# EAGLE design ambient_tag_v1 (EAGLE 7.6.0)
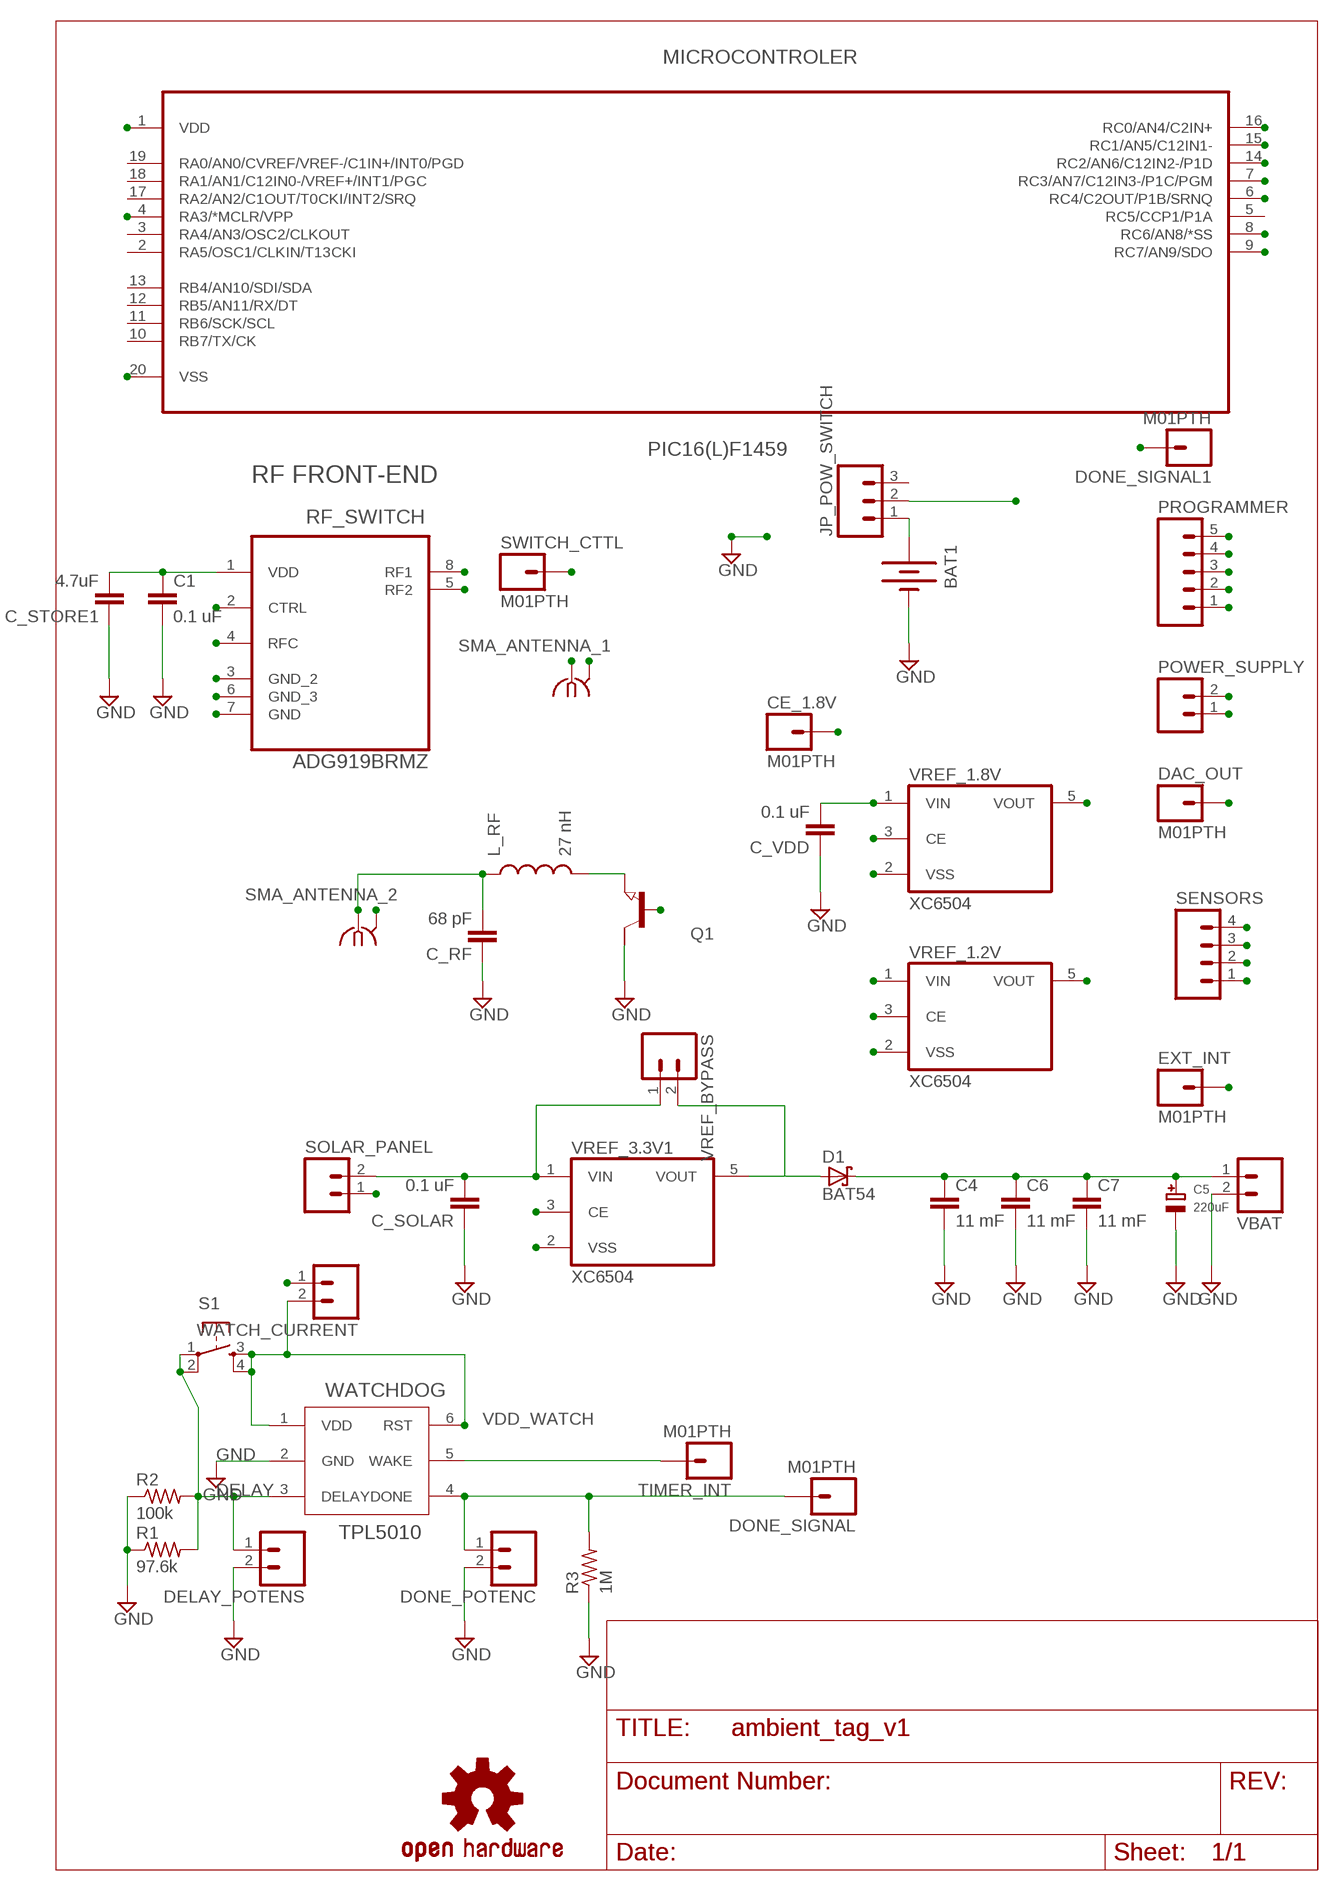
[diagram p0: schematic, sheet 1]

## Parts
BAT1  BATTERY20PTH_LAB  [BATTCOM_20MM_PTH]
C1  0.1 uF  CAP0603-CAP  [0603-CAP]
C4  11 mF  CAP1210  [1210]
C5  220uF  CAP_TANTALUMD/7343_REFLOW  [EIA7343-31/D-R]
C6  11 mF  CAP1210  [1210]
C7  11 mF  CAP1210  [1210]
C_RF  68 pF  CAP0603-CAP  [0603-CAP]
C_SOLAR  0.1 uF  CAP0603-CAP  [0603-CAP]
C_STORE1  4.7uF  1.0UF-25V-+80/-20(0805)  [0805]
C_VDD  0.1 uF  CAP0603-CAP  [0603-CAP]
CE_1.8V  M01PTH  [1X01]
D1  BAT54  [SOT23]
DAC_OUT  M01PTH  [1X01]
DELAY_POTENS  M02PTH  [1X02]
DONE_POTENC  M02PTH  [1X02]
DONE_SIGNAL  M01PTH  [1X01]
DONE_SIGNAL1  M01PTH  [1X01]
EXT_INT  M01PTH  [1X01]
JP_POW_SWITCH  M03LOCK  [1X03_LOCK]
L_RF  27 nH  INDUCTOR0603  [0603]
LOGO1  OSHW-LOGOL  [OSHW-LOGO-L]
MICROCONTROLER  PIC16(L)F1459  PIC18F13K22-I/SS  [SOP65P780X200-20N]
POWER_SUPPLY  M02PTH  [1X02]
PROGRAMMER  M05PTH  [1X05]
Q1  NPN-TRANSISTIOR-2COLSOT89  [SOT89]
R1  97.6k  R-US_R0805  [R0805]
R2  100k  R-US_R0805  [R0805]
R3  1M  R-US_R0805  [R0805]
RF_SWITCH  ADG919BRMZ  [SOP65P490X110-8N]
S1  TAC_SWITCHSMD  [TACTILE_SWITCH_SMD]
SENSORS  M04LOCK  [1X04_LOCK]
SMA_ANTENNA_1  SMA-142-0701-881/886  [J502-ND-142-0701-881/886]
SMA_ANTENNA_2  SMA-142-0701-881/886  [J502-ND-142-0701-881/886]
SOLAR_PANEL  M02PTH  [1X02]
SWITCH_CTTL  M01PTH  [1X01]
TIMER_INT  M01PTH  [1X01]
VBAT  M02PTH  [1X02]
VREF_1.2V  XC6504  XC6220MR  [SOT23-5]
VREF_1.8V  XC6504  XC6220MR  [SOT23-5]
VREF_3.3V1  XC6504  XC6220MR  [SOT23-5]
VREF_BYPASS  M02PTH  [1X02]
WATCH_CURRENT  M02PTH  [1X02]
WATCHDOG  TPL5010  [TSOT-23]

## Nets
CE: CE_1.8V.1 VREF_1.8V.3(CE)
DAC1: DAC_OUT.1 MICROCONTROLER.14(RC2/AN6/C12IN2-/P1D) Q1.1(B)
DELAY: DELAY_POTENS.1 R1.2 R2.2 S1.1 S1.2 WATCHDOG.3(DELAY)
DONE: DONE_POTENC.1 DONE_SIGNAL.1 R3.2 WATCHDOG.4(DONE)
DONE_OUT: DONE_SIGNAL1.1 MICROCONTROLER.7(RC3/AN7/C12IN3-/P1C/PGM)
GND: BAT1.2(-) C1.2 C4.2 C5.- C6.2 C7.2 C_RF.1 C_SOLAR.1 C_STORE1.1 C_VDD.1 DELAY_POTENS.2 DONE_POTENC.2 MICROCONTROLER.20(VSS) POWER_SUPPLY.1 PROGRAMMER.3 Q1.2(C) R1.1 R2.1 R3.1 RF_SWITCH.3(GND_2) RF_SWITCH.6(GND_3) RF_SWITCH.7(GND) SENSORS.1 SENSORS.3 SMA_ANTENNA_2.G@1 SMA_ANTENNA_2.G@2 SMA_ANTENNA_2.G@3 SMA_ANTENNA_2.G@4 SOLAR_PANEL.1 VBAT.2 VREF_1.2V.2(VSS) VREF_1.8V.2(VSS) VREF_3.3V1.2(VSS) WATCHDOG.2(GND)
MCLR: MICROCONTROLER.4(RA3/*MCLR/VPP) PROGRAMMER.5
N$1: L_RF.2 Q1.3(E)
N$2: TIMER_INT.1 WATCHDOG.5(WAKE)
N$3: D1.1(A) VREF_3.3V1.5(VOUT) VREF_BYPASS.2
N$6: BAT1.1(+) JP_POW_SWITCH.1
RF1: RF_SWITCH.8(RF1)
RF2: RF_SWITCH.5(RF2) SMA_ANTENNA_1.G@1 SMA_ANTENNA_1.G@2 SMA_ANTENNA_1.G@3 SMA_ANTENNA_1.G@4
RFC: RF_SWITCH.4(RFC) SMA_ANTENNA_1.1
SENSOR1: MICROCONTROLER.8(RC6/AN8/*SS) SENSORS.4
SENSOR2: MICROCONTROLER.9(RC7/AN9/SDO) SENSORS.2
SOLAR: C_SOLAR.2 SOLAR_PANEL.2 VREF_3.3V1.1(VIN) VREF_3.3V1.3(CE) VREF_BYPASS.1
SPCLK: EXT_INT.1 MICROCONTROLER.15(RC1/AN5/C12IN1-) PROGRAMMER.1
SPDAT: MICROCONTROLER.16(RC0/AN4/C2IN+) PROGRAMMER.2 VREF_1.2V.5(VOUT)
SWITCH_CTTL: MICROCONTROLER.6(RC4/C2OUT/P1B/SRNQ) RF_SWITCH.2(CTRL) SWITCH_CTTL.1
TRANSISTOR_OUT: C_RF.2 L_RF.1 SMA_ANTENNA_2.1
VDD: C4.1 C5.+ C6.1 C7.1 C_VDD.2 D1.3(C) JP_POW_SWITCH.2 VBAT.1 VREF_1.8V.1(VIN) WATCH_CURRENT.1
VDD_1.8V: C1.1 C_STORE1.2 MICROCONTROLER.1(VDD) POWER_SUPPLY.2 PROGRAMMER.4 RF_SWITCH.1(VDD) VREF_1.2V.1(VIN) VREF_1.2V.3(CE) VREF_1.8V.5(VOUT)
VDD_WATCH: S1.3 S1.4 WATCH_CURRENT.2 WATCHDOG.1(VDD) WATCHDOG.6(RST)
Unconnected: JP_POW_SWITCH.3 MICROCONTROLER.2(RA5/OSC1/CLKIN/T13CKI) MICROCONTROLER.3(RA4/AN3/OSC2/CLKOUT) MICROCONTROLER.5(RC5/CCP1/P1A) MICROCONTROLER.10(RB7/TX/CK) MICROCONTROLER.11(RB6/SCK/SCL) MICROCONTROLER.12(RB5/AN11/RX/DT) MICROCONTROLER.13(RB4/AN10/SDI/SDA) MICROCONTROLER.17(RA2/AN2/C1OUT/T0CKI/INT2/SRQ) MICROCONTROLER.18(RA1/AN1/C12IN0-/VREF+/INT1/PGC) MICROCONTROLER.19(RA0/AN0/CVREF/VREF-/C1IN+/INT0/PGD) Q1.2@1(C/)

## Notes on the sheet
- RF FRONT-END

## Library data of the parts
BAT1 = semipassiveTag_library:BATTERY: Battery Holders Various common sizes : AA, AAA, 20mm coin cell and 12mm coin cell.
C1 C_RF C_SOLAR C_VDD = SparkFun-Capacitors:CAP: Capacitor Standard 0603 ceramic capacitor, and 0.1" leaded capacitor.
C4 C6 C7 = SparkFun:CAP: Capacitor Standard 0603 ceramic capacitor, and 0.1" leaded capacitor.
C5 = microbuilder:CAP_TANTALUM: Tantalum Capacitors Wave footprints have larger pads and are meant to be used for hand soldering. Reflow footprints are optimised for solder paste and a reflow oven. EIA3216-18/A-[R/W] - Size A / 3216-18 / 1206 footprint 4.7µF 25V 10% Tantalum Capacitor 10µF 16V 10% Tantalum Capacitor [Digikey: 495-2236-2-ND] EIA3528-21/B-[R/W] - Size B / 3528-21 47µF 10V 10% Tantalum Capactior [Digikey: 495-2216-1-ND] EIA6032-28/C-[R/W] - Size C / 6032-28 10µF 35V 20% Tantalum Capacitor [Digikey: 495-2285-1-ND] 100µF 16V 10% Tantalum Capactior [Digikey: 399-5214-1-ND]
C_STORE1 = SparkFun-Capacitors:1.0UF-25V-+80/-20(0805): CAP-11625; PROD_ID: CAP-11625; VALUE: 1.0uF
CE_1.8V DAC_OUT DONE_SIGNAL DONE_SIGNAL1 EXT_INT SWITCH_CTTL TIMER_INT = SparkFun:M01: Header 1 Standard 1-pin 0.1" header. Use with straight break away headers (SKU : PRT-00116), right angle break away headers (PRT-00553), swiss pins (PRT-00743), machine pins (PRT-00117), and female headers (PRT-00115).
D1 = diode:BAT54: Schottky Diodes Source: Fairchild .. BAT54.pdf
DELAY_POTENS DONE_POTENC POWER_SUPPLY SOLAR_PANEL VBAT VREF_BYPASS WATCH_CURRENT = SparkFun:M02: Header 2 Standard 2-pin 0.1" header. Use with straight break away headers (SKU : PRT-00116), right angle break away headers (PRT-00553), swiss pins (PRT-00743), machine pins (PRT-00117), and female headers (PRT-00115). Molex polarized connector foot print use with SKU : PRT-08233 with associated crimp pins and housings.
JP_POW_SWITCH = SparkFun-Connectors:M03: Header 3 Standard 3-pin 0.1" header. Use with straight break away headers (SKU : PRT-00116), right angle break away headers (PRT-00553), swiss pins (PRT-00743), machine pins (PRT-00117), and female headers (PRT-00115). Molex polarized connector foot print use with SKU : PRT-08232 with associated crimp pins and housings.
L_RF = SparkFun:INDUCTOR: Inductors Basic Inductor/Choke - 0603 and 1206. Footprints are not proven and vary greatly between part numbers.
LOGO1 = SparkFun-Aesthetics:OSHW-LOGO: Open Source Hardware Logo This logo indicates the piece of hardware it is found on incorporates a OSHW license and/or adheres to the definition of open source hardware found here: http://freedomdefined.org/OSHW
MICROCONTROLER = Microchip_By_element14_Batch_1:PIC18F13K22-I/SS: Flash Microcontrollers; MPN: PIC18F13k22-I/SS; OC_FARNELL: 1778460; OC_NEWARK: 07P9666; PACKAGE: SSOP-20; SUPPLIER: Microchip
PROGRAMMER = SparkFun:M05: Header 5 Standard 5-pin 0.1" header. Use with straight break away headers (SKU : PRT-00116), right angle break away headers (PRT-00553), swiss pins (PRT-00743), machine pins (PRT-00117), and female headers (PRT-00115). Molex polarized connector foot print use with SKU : PRT-08230 with associated crimp pins and housings.
Q1 = semicon-smd-ipc:NPN-TRANSISTIOR-2COL: NPN TRANSISTOR 2 colletor pins
R1-R3 = adafruit:R-US_: RESISTOR, American symbol
RF_SWITCH = analog-devices-Phase-2:ADG919BRMZ: 1.65 V to 2.75 V, 2:1 Mux/SPDT; MPN: ADG919BRMZ; OC_FARNELL: 1346347; OC_NEWARK: 59K1711; PACKAGE: MSOP-8; SUPPLIER: Analog Devices
S1 = SparkFun:TAC_SWITCH: Momentary Switch Button commonly used for reset or general input. Spark Fun Electronics SKU : COM-00097
SENSORS = SparkFun:M04: Header 4 Standard 4-pin 0.1" header. Use with straight break away headers (SKU : PRT-00116), right angle break away headers (PRT-00553), swiss pins (PRT-00743), machine pins (PRT-00117), and female headers (PRT-00115). Molex polarized connector foot print use with SKU : PRT-08231 with associated crimp pins and housings. 1MM SMD Version SKU: PRT-10208
SMA_ANTENNA_1 SMA_ANTENNA_2 = con-coax:SMA-: SMA 50 Ohm End Launch Jack Receptacle - Round Contact Johnson Components Source: www.johnsoncomponents.com .. J502-ND.pdf; MF: JOHNSON COMPONENTS; MPN: 142-0701-881; OC_FARNELL: 1608603; OC_NEWARK: 08B906
VREF_1.2V VREF_1.8V VREF_3.3V1 = torex:XC6220: LDO Regulator 1A
WATCHDOG = Custom Components:TPL5010

## Board
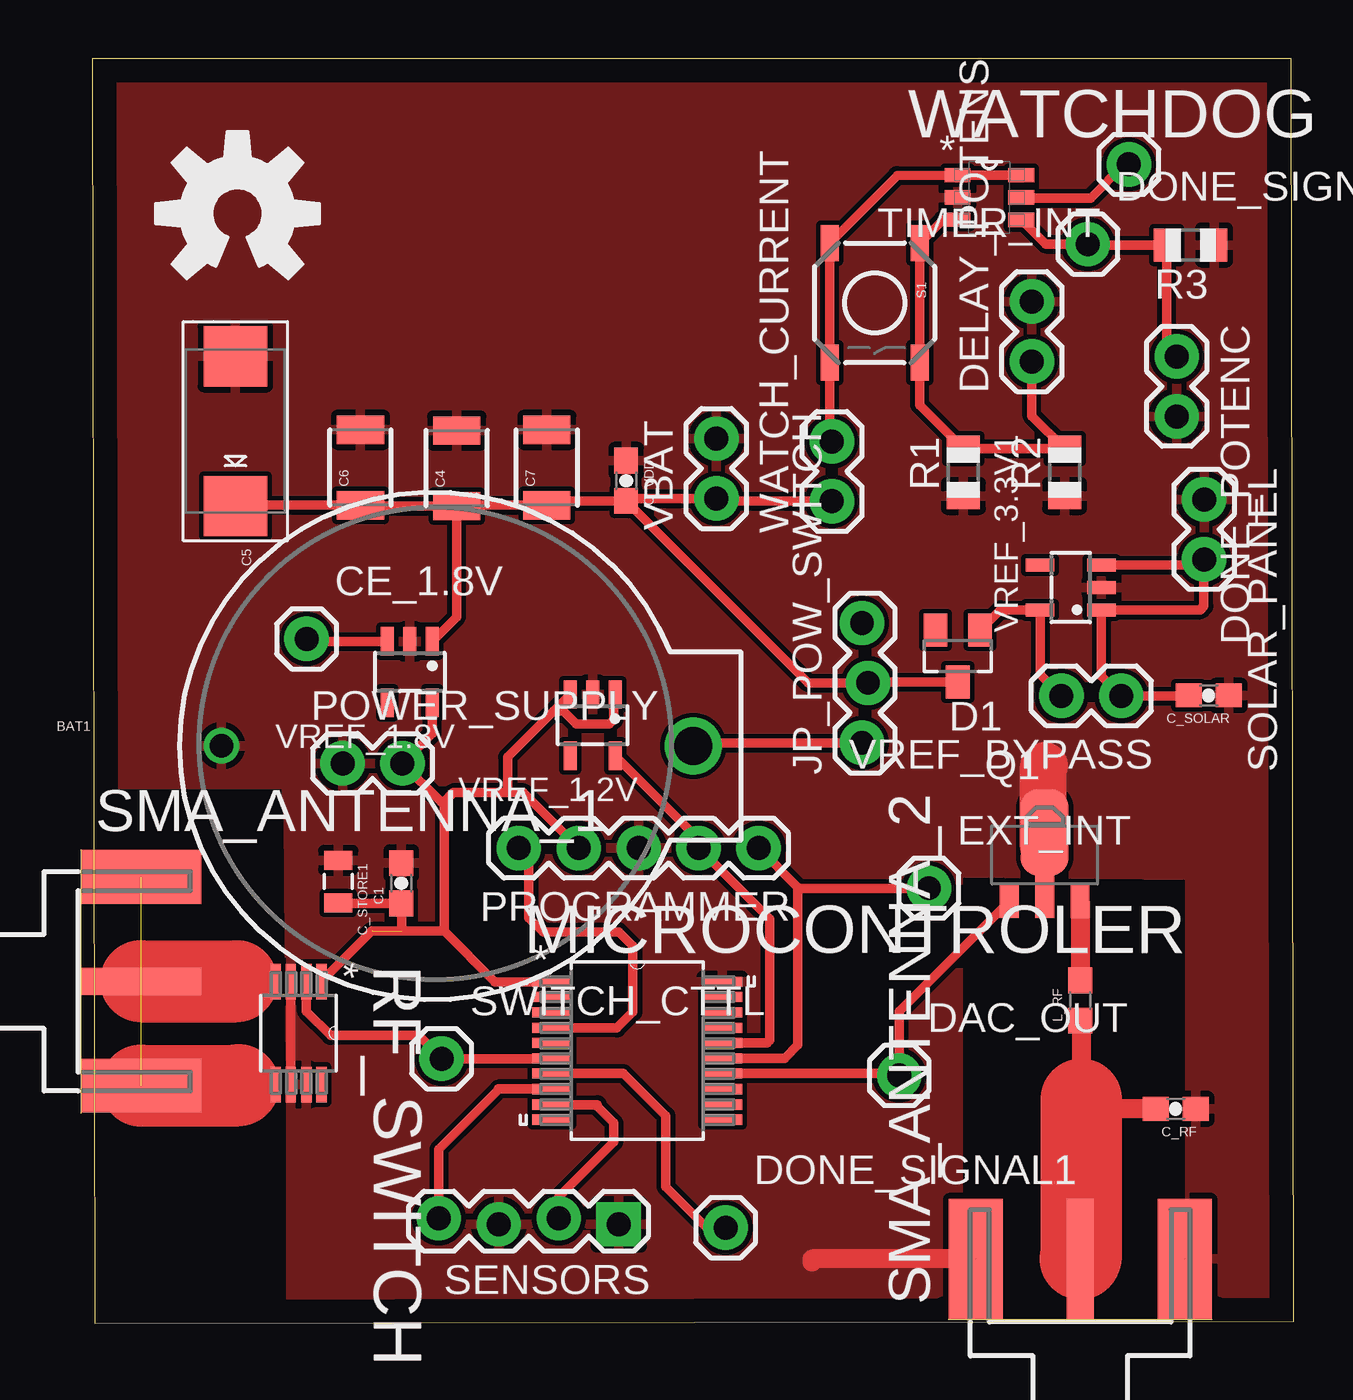
[diagram p1: board, top side]
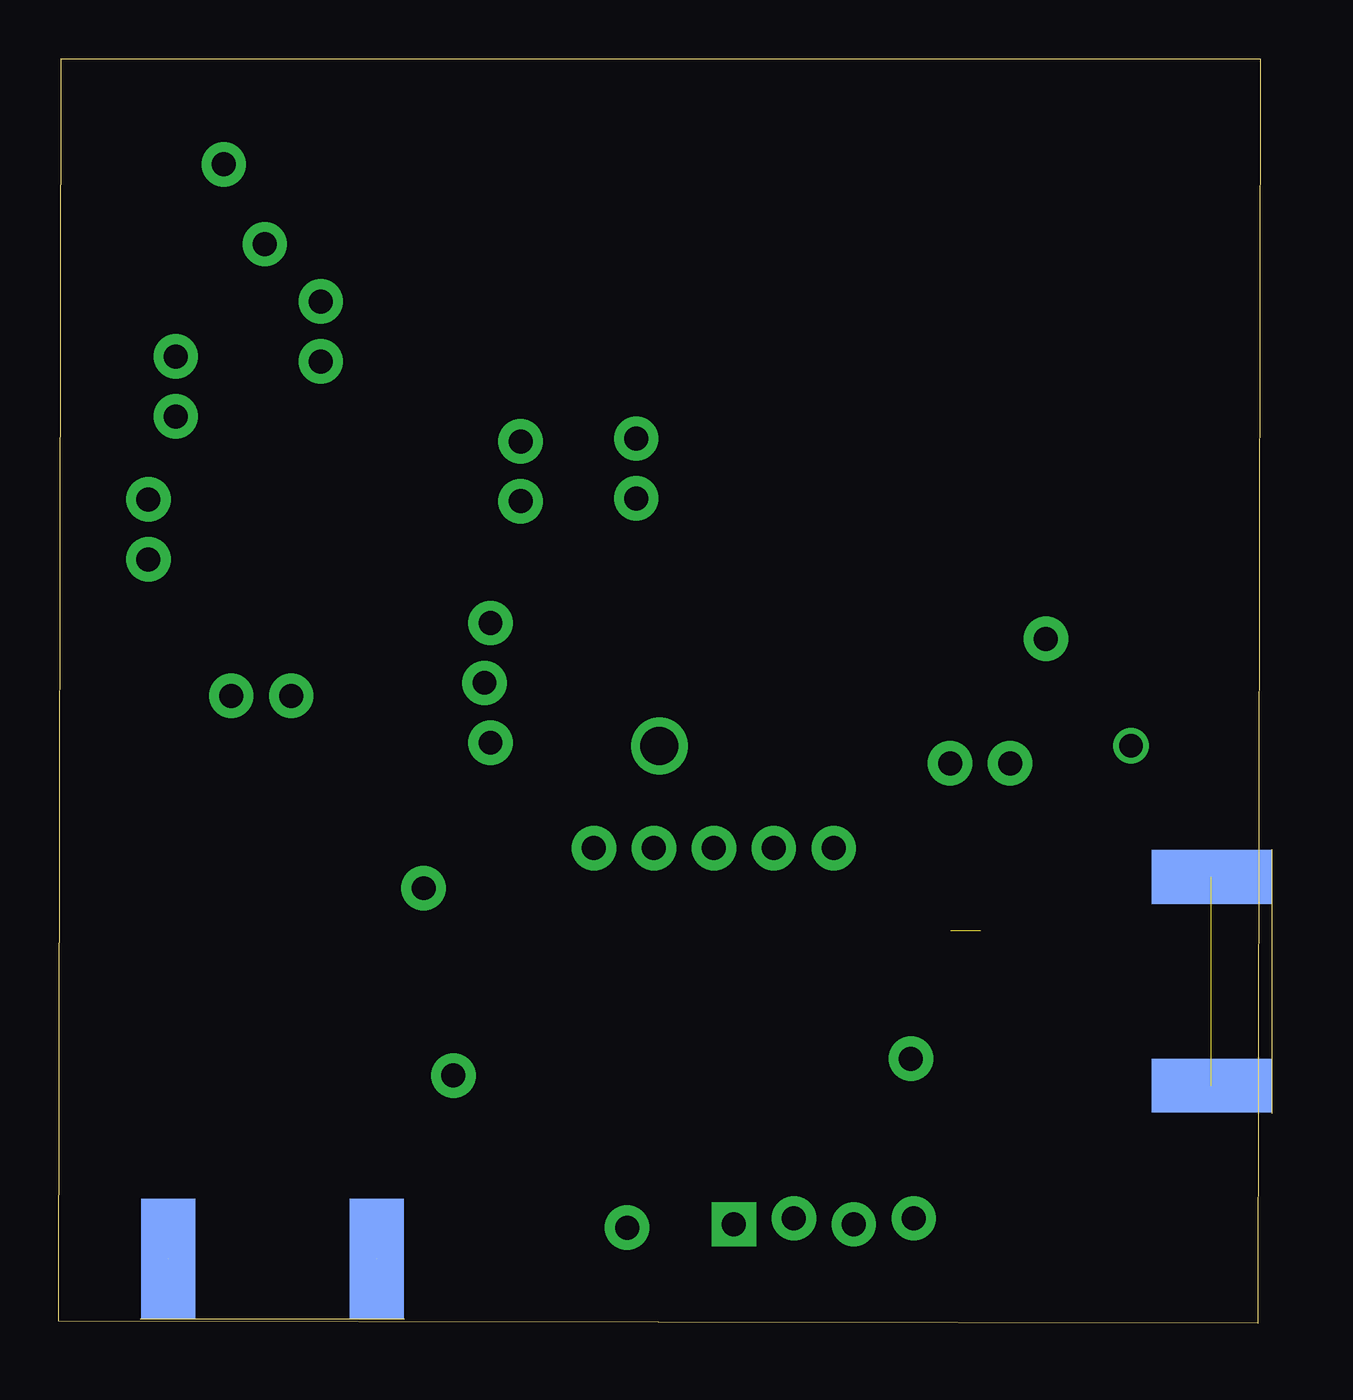
[diagram p2: board, bottom side, seen from below]

Size 50.9 x 53.6 mm. Coordinates in mm from the lower left corner, seen from the top.
Outline: 0.1,0 50.9,0.1 50.8,53.6 0,53.6 0.1,0
Copper layers (1*16): Top 0.035mm / dielectric 1.5mm / Bottom 0.035mm
Design rules "default": minimum track width 10mil, minimum drill 24mil, track to track 8mil, track to pad 8mil, pad to pad 8mil, via to via 8mil, smd to smd 8mil, copper to edge 40mil, drill to drill 8mil, minimum pad ring 10mil, minimum via ring 8mil, stop-mask expansion 4mil, vias tented up to drill 0mil, thermal gap 10mil

### Footprints (pad centres in the part's own frame; a part is rotated, then mirrored left to right if it is on the bottom)
BATTCOM_20MM_PTH = drill 1.6: 1 19.99,0 | drill 1: 2 0,0
0603-CAP = smd 1.1 x 1: 1 -0.85,0; 2 0.85,0
1210 = smd 1.2 x 2: 1 -1.6,0; 2 1.6,0
EIA7343-31/D-R = smd 2.55 x 2.7: + 3.175,0; - -3.175,0
0805 = smd 0.8 x 1.2: 1 -0.9,0; 2 0.9,0
1X01 = drill 1.016 pad 1.88: 1 0,0
SOT23 = smd 1 x 1.4: 1 -0.95,-1.1; 2 0.95,-1.1; 3 0,1.1
1X02 = drill 1.016 pad 1.88: 1 0,0; 2 2.54,0
1X03_LOCK = drill 1 pad 1.88: 1 0,0.127; 2 2.54,-0.127; 3 5.08,0.127
0603 = smd 1.1 x 1: 1 -0.85,0; 2 0.85,0
SOP65P780X200-20N = smd 1.676 x 0.432: 1 -3.607,2.921; 2 -3.607,2.286; 3 -3.607,1.626; 4 -3.607,0.965; 5 -3.607,0.33; 6 -3.607,-0.33; 7 -3.607,-0.965; 8 -3.607,-1.626; 9 -3.607,-2.286; 10 -3.607,-2.921; 11 3.607,-2.921; 12 3.607,-2.286; 13 3.607,-1.626; 14 3.607,-0.965; 15 3.607,-0.33; 16 3.607,0.33; 17 3.607,0.965; 18 3.607,1.626; 19 3.607,2.286; 20 3.607,2.921
1X05 = drill 1.016 pad 1.88: 1 0,0; 2 2.54,0; 3 5.08,0; 4 7.62,0; 5 10.16,0
SOT89 = smd 0.8 x 1.4: 1 -1.499,-1.981; 3 1.499,-1.981 | smd 0.8 x 1.9: 2 0,-1.727 | smd 2.032 x 3.65: 2@1 0,0.94
R0805 = smd 1.1 x 1.4: 1 -1,0; 2 1,0
SOP65P490X110-8N = smd 1.499 x 0.432: 1 -2.184,0.965; 2 -2.184,0.33; 3 -2.184,-0.33; 4 -2.184,-0.965; 5 2.184,-0.965; 6 2.184,-0.33; 7 2.184,0.33; 8 2.184,0.965
TACTILE_SWITCH_SMD = smd 1.524 x 0.762: 1 -2.54,1.905; 2 2.54,1.905; 3 -2.54,-1.905; 4 2.54,-1.905
1X04_LOCK = drill 1.016 pad 1.88 square: 1 0,0.127 | drill 1.016 pad 1.88: 2 2.54,-0.127; 3 5.08,0.127; 4 7.62,-0.127
J502-ND-142-0701-881/886 = smd 5.08 x 1.143: 1 2.565,0 | smd 5.08 x 2.286: G@1 2.565,4.42; G@2 2.565,-4.42 | smd 5.08 x 2.286 bottom: G@3 2.565,4.42; G@4 2.565,-4.42
SOT23-5 = smd 0.55 x 1.2: 1 -0.95,-1.3; 2 0,-1.3; 3 0.95,-1.3; 4 0.95,1.3; 5 -0.95,1.3
TSOT-23 = smd 1.1 x 0.6: 1 -1.35,0.95; 2 -1.35,0; 3 -1.35,-0.94; 4 1.35,-0.95; 5 1.35,0; 6 1.35,0.95

### Placement (x,y rotation side)
BAT1  5.47,24.48 0 top
C1  13.09,18.66 90 top
C4  15.44,36.25 90 top
C5  6.06,37.82 270 top
C6  11.36,36.28 90 top
C7  19.26,36.28 90 top
C_RF  45.9,9.09 180 top
C_SOLAR  47.3,26.62 180 top
C_STORE1  10.42,18.73 270 top
C_VDD  22.62,35.72 270 top
CE_1.8V  9.08,29.02 0 top
D1  36.67,28.29 180 top
DAC_OUT  34.19,10.51 0 top
DELAY_POTENS  39.81,40.78 90 top
DONE_POTENC  45.95,40.99 270 top
DONE_SIGNAL  42.18,45.75 0 top
DONE_SIGNAL1  26.83,4.06 0 top
EXT_INT  35.45,18.45 0 top
JP_POW_SWITCH  32.74,24.61 90 top
L_RF  41.86,13.69 90 top
LOGO1  6.15,47.05 0 top
MICROCONTROLER  23.09,11.56 0 top
POWER_SUPPLY  10.6,23.74 0 top
PROGRAMMER  28.23,20.15 180 top
Q1  40.35,19.87 0 top
R1  36.91,36.08 90 top
R2  41.2,36.08 90 top
R3  46.53,45.71 180 top
RF_SWITCH  8.74,12.31 270 top
S1  33.15,43.26 270 top
SENSORS  22.3,4.33 180 top
SMA_ANTENNA_1  -0.5,14.5 0 top
SMA_ANTENNA_2  41.86,0.17 90 top
SOLAR_PANEL  47.11,34.93 270 top
SWITCH_CTTL  14.8,11.22 0 top
TIMER_INT  43.92,49.13 180 top
VBAT  26.44,34.97 90 top
VREF_1.2V  21.2,25.36 180 top
VREF_1.8V  13.45,27.61 180 top
VREF_3.3V1  41.46,31.2 90 top
VREF_BYPASS  43.6,26.6 180 top
WATCH_CURRENT  31.34,34.85 90 top
WATCHDOG  38.01,47.73 0 top

### Tracks (layer width: path | path; a pad name or v marks a point on that pad's centre or on a via)
CE
  Top 0.406: CE_1.8V.1 9.19,28.91 VREF_1.8V.3
DAC1
  Top 0.4: MICROCONTROLER.14 34.19,10.59 DAC_OUT.1 34.19,13.23 Q1.1
DELAY
  Top 0.406: DELAY_POTENS.1 39.81,38.47 R2.2 R1.2 35.05,38.93 S1.2 S1.1 36.05,46.79 WATCHDOG.3
DONE
  Top 0.406: DONE_POTENC.1 45.53,41.41 R3.2 42.22,45.71 DONE_SIGNAL.1 40.39,45.75 WATCHDOG.4
DONE_OUT
  Top 0.406: MICROCONTROLER.7 22.5,10.6 24.3,8.8 24.3,5.8 26.04,4.06 DONE_SIGNAL1.1
GND  (2 unrouted)
  Top 0.406: RF_SWITCH.6 RF_SWITCH.3
  Top 0.8: SMA_ANTENNA_2.G@3 30.5,2.73 30.5,2.6 | 40.35,23.65 40.5,23.8 | Q1.2 40.35,20.15 40.3,20.2
  Top 2: 40.3,20.2 40.3,23.6 40.35,23.65
  pour Top: 51.41,53.85 -0.14,53.95 -0.04,22.85 8.2,22.85 8.3,21.5 8.4,7.85 8.4,-0.6 36.7,-0.5 36.7,19.1 46.5,19 46.5,-0.55 51.61,-0.55
MCLR
  Top 0.406: PROGRAMMER.5 18.5,19.72 18.5,17.2 19.1,16.6 22.3,16.6 22.9,16 22.9,13.2 22.23,12.52 MICROCONTROLER.4
N$1
  Top 0.8: Q1.3 L_RF.2
N$2
  Top 0.406: WATCHDOG.5 39.39,47.7 42.3,47.7 43.73,49.13 TIMER_INT.1
N$3
  Top 0.4: VREF_3.3V1.5 40.16,27.5 VREF_BYPASS.2
  Top 0.406: D1.1 38.48,30.25 VREF_3.3V1.5
N$6
  Top 0.406: BAT1.1 25.59,24.61 JP_POW_SWITCH.1
RF2  (3 unrouted)
  Top 0.4: 6.2,10.1 RF_SWITCH.5
  Top 3.48: SMA_ANTENNA_1.G@4 6.2,10.1
RFC
  Top 0.4: 6.1,14.5 RF_SWITCH.4
  Top 3.48: SMA_ANTENNA_1.1 6.1,14.5
SENSOR1
  Top 0.406: SENSORS.4 14.68,7.38 17.2,9.9 17.2,9.93 MICROCONTROLER.8
SENSOR2
  Top 0.406: MICROCONTROLER.9 21.4,9.27 21.4,9.2 22.1,8.5 22.1,7.7 19.76,5.36 SENSORS.2
SOLAR
  Top 0.4: C_SOLAR.2 46.43,26.6 VREF_BYPASS.1 42.76,27.44 VREF_3.3V1.1 46.95,30.25 47.1,30.4 SOLAR_PANEL.2 46.87,32.15 VREF_3.3V1.3
SPCLK
  Top 0.406: PROGRAMMER.1 29.9,18.48 | 29.9,18.48 29.9,11.8 29.33,11.23 MICROCONTROLER.15 | 29.9,18.48 29.93,18.45 EXT_INT.1
SPDAT
  Top 0.406: MICROCONTROLER.16 28.59,11.89 28.7,12 28.7,17.14 PROGRAMMER.2 25.69,20.52 VREF_1.2V.5
SWITCH_CTTL
  Top 0.406: MICROCONTROLER.6 SWITCH_CTTL.1 13.82,12.2 10.1,12.2 9.07,13.23 RF_SWITCH.2
TRANSISTOR_OUT
  Top 0.8: C_RF.2 41.9,9.09 41.9,9.1 | L_RF.1 41.9,12.84 41.9,9.5
  Top 3.46: SMA_ANTENNA_2.1 41.9,2.83 41.9,9.1 41.9,9.5
VDD
  Top 0.406: D1.3 32.91,27.19 JP_POW_SWITCH.2 30.34,27.15 C_VDD.2 | C4.1 11.39,34.65 C6.1 6.09,34.68 C5.+ | C4.1 15.47,34.68 C7.1 19.45,34.87 C_VDD.2 | VREF_1.8V.1 15.44,29.95 C4.1 | C_VDD.2 22.72,34.97 VBAT.1 26.56,34.85 WATCH_CURRENT.1
VDD_1.8V  (1 unrouted)
  Top 0.406: RF_SWITCH.1 11.84,16.63 14.9,16.63 | 13.11,16.63 C1.1 10.44,17.81 C_STORE1.2 | PROGRAMMER.4 18.26,22.5 17.6,22.5 | 17.6,22.5 15.3,22.5 14.9,22.1 | 14.9,22.1 14.9,16.63 | 14.9,16.63 17.05,14.48 MICROCONTROLER.1 | 14.9,22.1 14.78,22.1 POWER_SUPPLY.2 14.4,25 VREF_1.8V.5 | VREF_1.2V.3 19.55,25.95 | 19.55,25.95 17.6,24.01 17.6,22.5 | VREF_1.2V.1 22.1,26.61 22.1,25.6 21.9,25.4 20.5,25.4 19.95,25.95 19.55,25.95
VDD_WATCH
  Top 0.406: WATCH_CURRENT.2 31.25,37.48 S1.4 S1.3 34.11,48.66 WATCHDOG.1 WATCHDOG.6